# Altium schematic sheet ledBoard.SchDoc
size A4
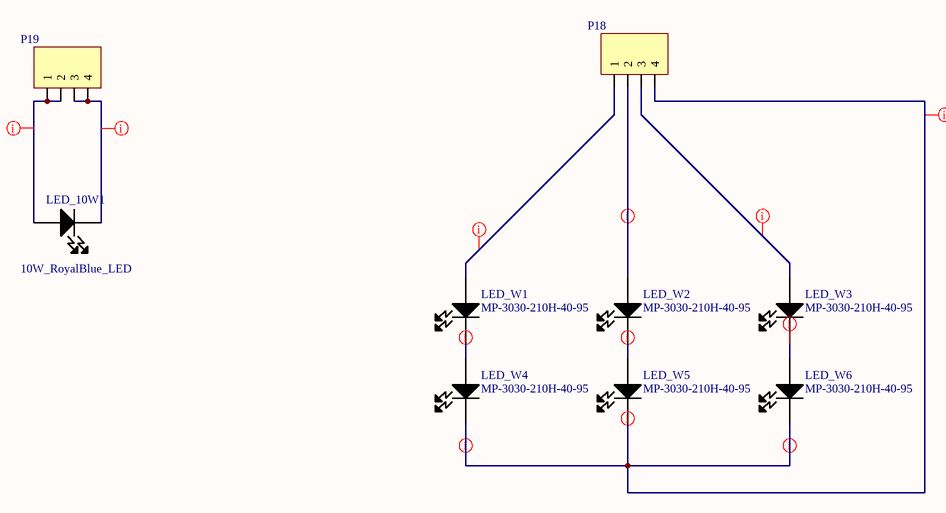
[diagram p0: ledBoard.SchDoc]

## Parts
LED_10W1  10W_RoyalBlue_LED  [10W_LED_200200]
LED_W1  MP-3030-210H-40-95  [MP-3030-210H-40-95]
LED_W2  MP-3030-210H-40-95  [MP-3030-210H-40-95]
LED_W3  MP-3030-210H-40-95  [MP-3030-210H-40-95]
LED_W4  MP-3030-210H-40-95  [MP-3030-210H-40-95]
LED_W5  MP-3030-210H-40-95  [MP-3030-210H-40-95]
LED_W6  MP-3030-210H-40-95  [MP-3030-210H-40-95]
P18  Mini-Fit Jr 4 Pos  [MOLEX 0039281043]  (value not drawn)
P19  Mini-Fit Jr 4 Pos  [MOLEX 0039281043]  (value not drawn)

## Nets
NetLED_10W1_1: LED_10W1.1(-) P19.3 P19.4
NetLED_10W1_2: LED_10W1.2(+) P19.1 P19.2
NetLED_W1_1: LED_W1.1(-) LED_W4.2(+)
NetLED_W1_2: LED_W1.2(+) P18.1
NetLED_W2_1: LED_W2.1(-) LED_W5.2(+)
NetLED_W2_2: LED_W2.2(+) P18.2
NetLED_W3_1: LED_W3.1(-) LED_W6.2(+)
NetLED_W3_2: LED_W3.2(+) P18.3
NetLED_W4_1: LED_W4.1(-) LED_W5.1(-) LED_W6.1(-) P18.4

## Layout directives
net class PowerNet: NetLED_W4_1
rule Width Constraint [Pref Width = 15mil    Min Width = 15mil    Max Width = 15mil]: NetLED_10W1_1, NetLED_10W1_2, NetLED_W1_1, NetLED_W1_2, NetLED_W2_1, NetLED_W2_2, NetLED_W3_1, NetLED_W3_2, NetLED_W4_1

## Library data of the parts
LED_10W1 = 10W_RoyalBlue_LED: 445nm LED
LED_W1-LED_W6 = MP-3030-210H-40-95: White 4000K neutral 1.5W 95CRI SMT3030 LED 6V 150mA
P18 P19 = Molex 0039281043: Mini-Fit Jr. Header, Dual Row, Right-Angle, with Snap-in Plastic Peg PCB Lock, 6 Circuits, PA Polyamide Nylon 6/6 94V-2, 0.76µm Select Gold (Au) Plating